# Altium schematic sheet WCAM-BREAKOUT-PCB-R03.SchDoc: WCAM-BREAKOUT-PCB-R03
size 594 x 420 mm; Author: T. Ludemann; Revision: 0.3; SheetNumber: 1; SheetTotal: 1; DocSize: DINA2
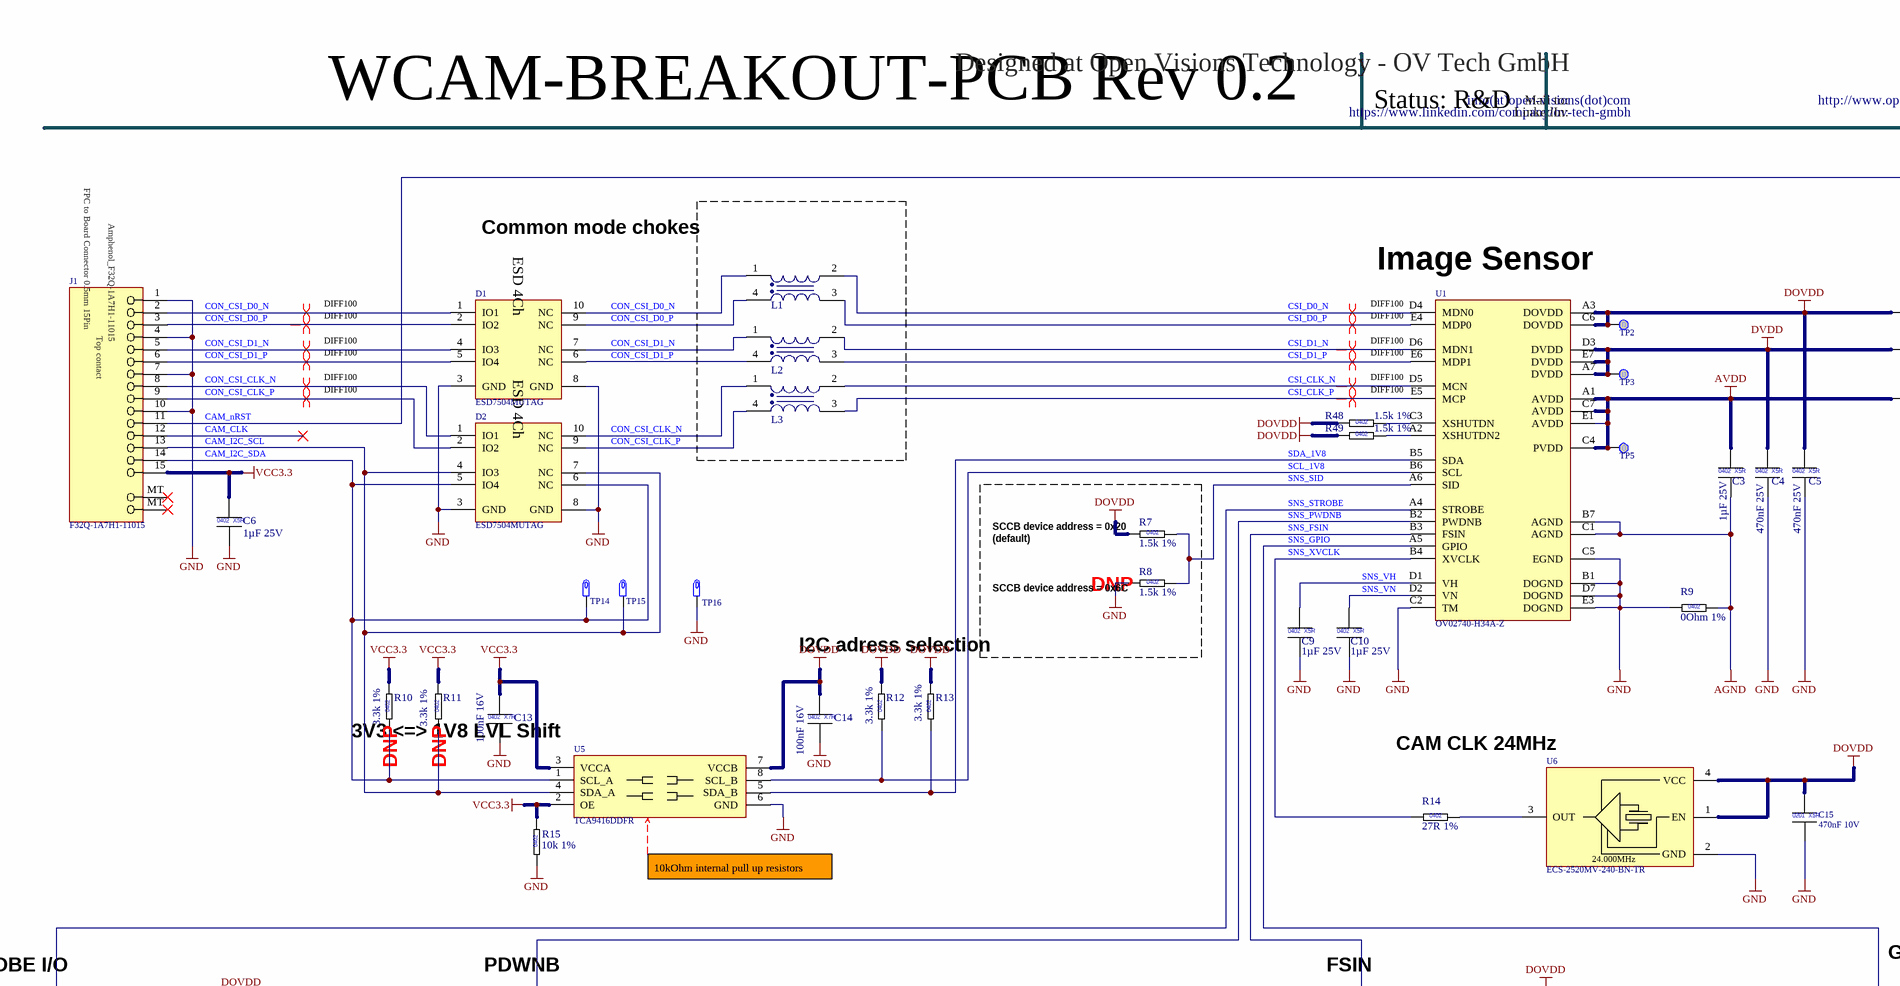
[diagram p0: WCAM-BREAKOUT-PCB-R03.SchDoc, top left]
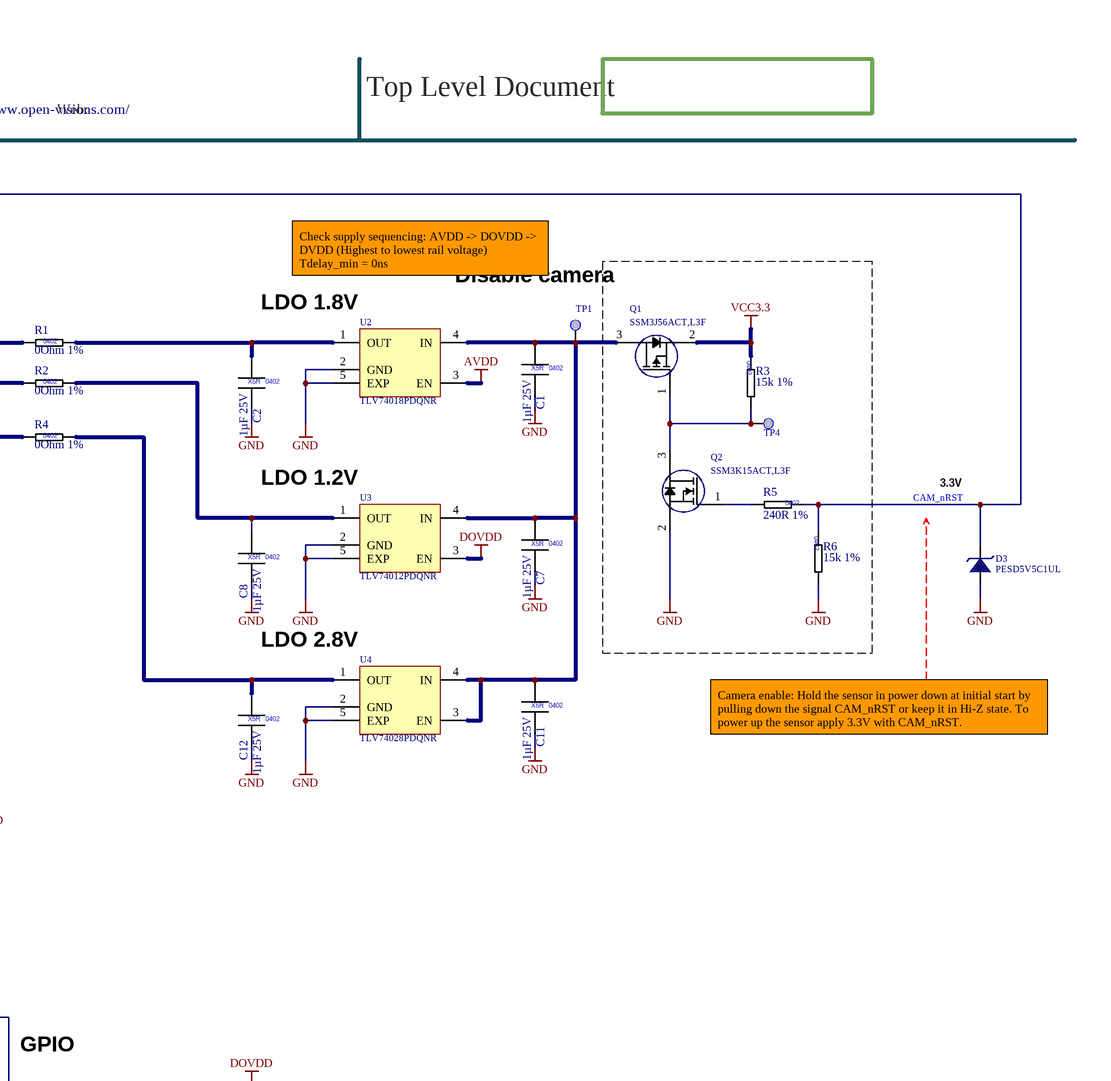
[diagram p1: WCAM-BREAKOUT-PCB-R03.SchDoc, top right]
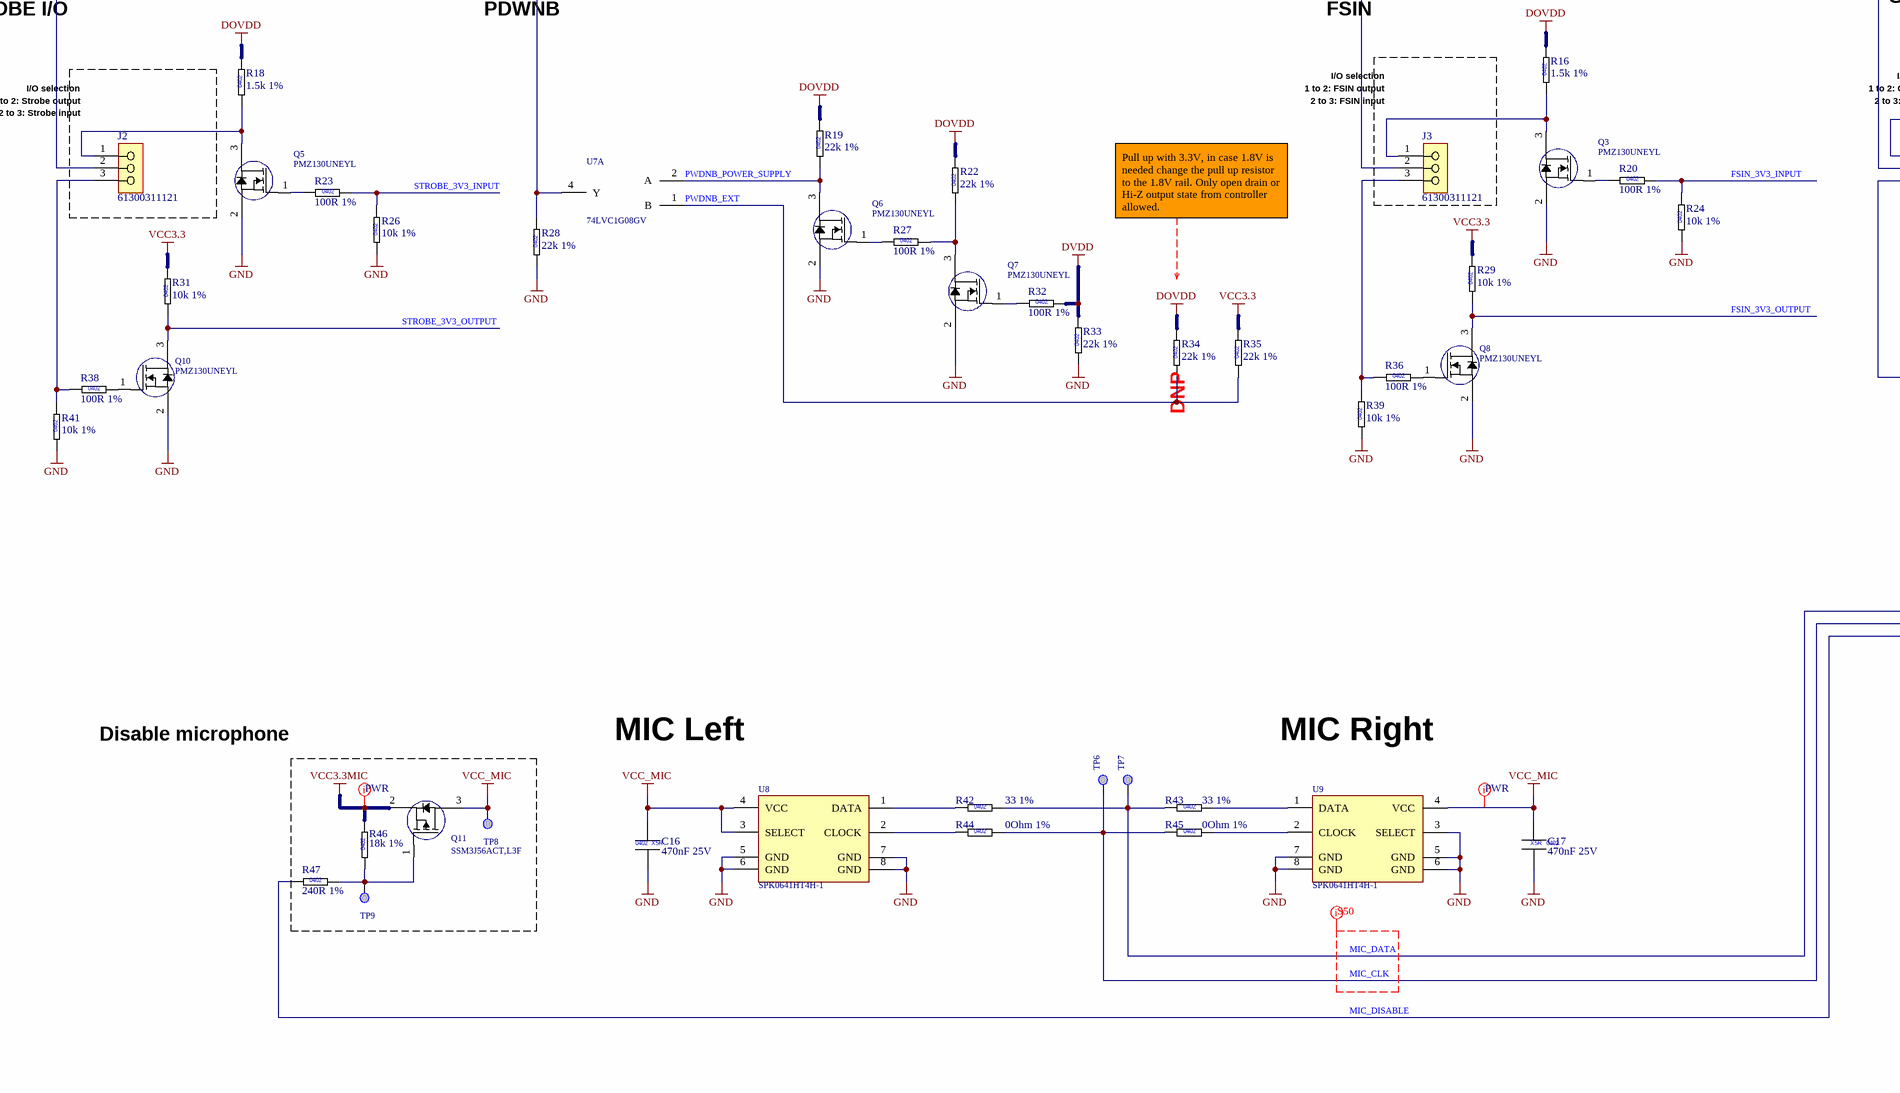
[diagram p2: WCAM-BREAKOUT-PCB-R03.SchDoc, bottom left]
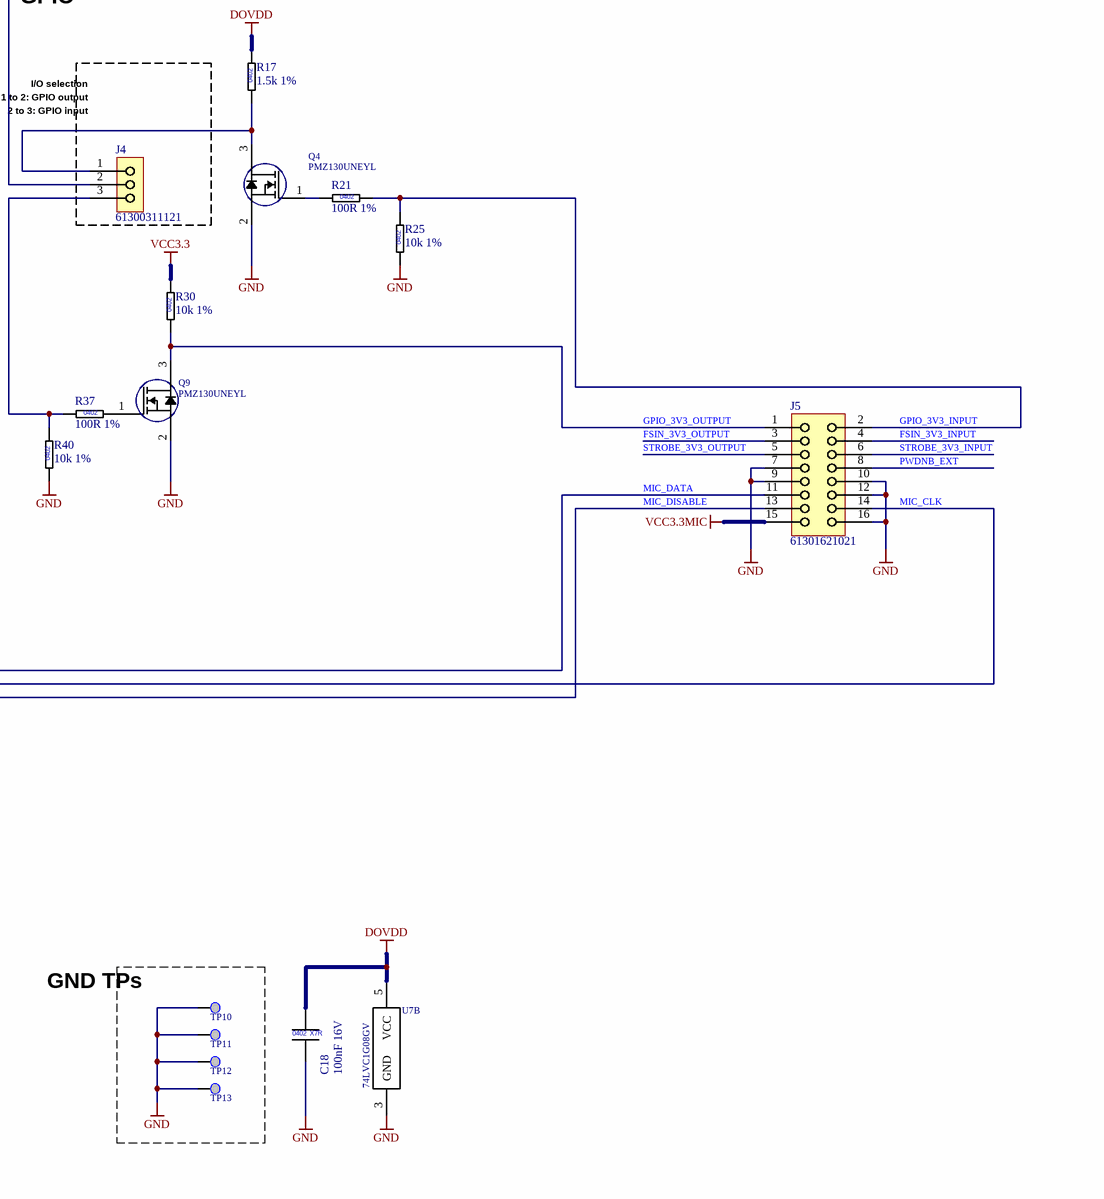
[diagram p3: WCAM-BREAKOUT-PCB-R03.SchDoc, bottom right]

## Parts
?  (no value)  (graphical)
C1  1µF 25V  [CAPC1005X06L]
C2  1µF 25V  [CAPC1005X06L]
C3  1µF 25V  [CAPC1005X06L]
C4  470nF 25V  [CAPC1005X06L]
C5  470nF 25V  [CAPC1005X06L]
C6  1µF 25V  [CAPC1005X06L]
C7  1µF 25V  [CAPC1005X06L]
C8  1µF 25V  [CAPC1005X06L]
C9  1µF 25V  [CAPC1005X06L]
C10  1µF 25V  [CAPC1005X06L]
C11  1µF 25V  [CAPC1005X06L]
C12  1µF 25V  [CAPC1005X06L]
C13  100nF 16V  [CAPC1005X06L]
C14  100nF 16V  [CAPC1005X06L]
C15  470nF 10V  [CAPC0603X03L]
C16  470nF 25V  [CAPC1005X06L]
C17  470nF 25V  [CAPC1005X06L]
C18  100nF 16V  [CAPC1005X06L]
D1  ESD7504MUTAG  [QFN50P250X100X55-10L]
D2  ESD7504MUTAG  [QFN50P250X100X55-10L]
D3  PESD5V5C1UL  [DFN65P100X50-2N]
J1  F32Q-1A7H1-11015  [FFC 15pol 0.5mm F32Q-1A7H1-11015]
J2  61300311121  [BOARD TO BOARD Pinheader WE_61300311121]
J3  61300311121  [BOARD TO BOARD Pinheader WE_61300311121]
J4  61300311121  [BOARD TO BOARD Pinheader WE_61300311121]
J5  61301621021  [BOARD TO BOARD Pinheader WE_61301621021]
L1  90Ohm 100mA  [CAF-50P85X64-4N]  (value not drawn)
L2  90Ohm 100mA  [CAF-50P85X64-4N]  (value not drawn)
L3  90Ohm 100mA  [CAF-50P85X64-4N]  (value not drawn)
Q1  SSM3J56ACT,L3F  [DFN65P100X50-3L]
Q2  SSM3K15ACT,L3F  [DFN65P100X50-3L]
Q3  PMZ130UNEYL  [DFN65P98X50-3N]
Q4  PMZ130UNEYL  [DFN65P98X50-3N]
Q5  PMZ130UNEYL  [DFN65P98X50-3N]
Q6  PMZ130UNEYL  [DFN65P98X50-3N]
Q7  PMZ130UNEYL  [DFN65P98X50-3N]
Q8  PMZ130UNEYL  [DFN65P98X50-3N]
Q9  PMZ130UNEYL  [DFN65P98X50-3N]
Q10  PMZ130UNEYL  [DFN65P98X50-3N]
Q11  SSM3J56ACT,L3F  [DFN65P100X50-3L]
R1  0Ohm 1%  [RESC1005X04L]
R2  0Ohm 1%  [RESC1005X04L]
R3  15k 1%  [RESC1005X04L]
R4  0Ohm 1%  [RESC1005X04L]
R5  240R 1%  [RESC1005X04L]
R6  15k 1%  [RESC1005X04L]
R7  1.5k 1%  [RESC1005X04L]
R8  1.5k 1%  [RESC1005X04L]
R9  0Ohm 1%  [RESC1005X04L]
R10  3.3k 1%  [RESC1005X04L]
R11  3.3k 1%  [RESC1005X04L]
R12  3.3k 1%  [RESC1005X04L]
R13  3.3k 1%  [RESC1005X04L]
R14  27R 1%  [RESC1005X04L]
R15  10k 1%  [RESC1005X04L]
R16  1.5k 1%  [RESC1005X04L]
R17  1.5k 1%  [RESC1005X04L]
R18  1.5k 1%  [RESC1005X04L]
R19  22k 1%  [RESC1005X04L]
R20  100R 1%  [RESC1005X04L]
R21  100R 1%  [RESC1005X04L]
R22  22k 1%  [RESC1005X04L]
R23  100R 1%  [RESC1005X04L]
R24  10k 1%  [RESC1005X04L]
R25  10k 1%  [RESC1005X04L]
R26  10k 1%  [RESC1005X04L]
R27  100R 1%  [RESC1005X04L]
R28  22k 1%  [RESC1005X04L]
R29  10k 1%  [RESC1005X04L]
R30  10k 1%  [RESC1005X04L]
R31  10k 1%  [RESC1005X04L]
R32  100R 1%  [RESC1005X04L]
R33  22k 1%  [RESC1005X04L]
R34  22k 1%  [RESC1005X04L]
R35  22k 1%  [RESC1005X04L]
R36  100R 1%  [RESC1005X04L]
R37  100R 1%  [RESC1005X04L]
R38  100R 1%  [RESC1005X04L]
R39  10k 1%  [RESC1005X04L]
R40  10k 1%  [RESC1005X04L]
R41  10k 1%  [RESC1005X04L]
R42  33 1%  [RESC1005X04L]
R43  33 1%  [RESC1005X04L]
R44  0Ohm 1%  [RESC1005X04L]
R45  0Ohm 1%  [RESC1005X04L]
R46  18k 1%  [RESC1005X04L]
R47  240R 1%  [RESC1005X04L]
R48  1.5k 1%  [RESC1005X04L]
R49  1.5k 1%  [RESC1005X04L]
TP1  Testpoint 0.5mm  [TP_0.50mm]  (value not drawn)  (no BOM)
TP2  Testpoint 0.5mm  [TP_0.50mm]  (value not drawn)  (no BOM)
TP3  Testpoint 0.5mm  [TP_0.50mm]  (value not drawn)  (no BOM)
TP4  Testpoint 0.5mm  [TP_0.50mm]  (value not drawn)  (no BOM)
TP5  Testpoint 0.5mm  [TP_0.50mm]  (value not drawn)  (no BOM)
TP6  Testpoint 0.5mm  [TP_0.50mm]  (value not drawn)  (no BOM)
TP7  Testpoint 0.5mm  [TP_0.50mm]  (value not drawn)  (no BOM)
TP8  Testpoint 0.5mm  [TP_0.50mm]  (value not drawn)  (no BOM)
TP9  Testpoint 0.5mm  [TP_0.50mm]  (value not drawn)  (no BOM)
TP10  Testpoint 0.5mm  [TP_0.50mm]  (value not drawn)  (no BOM)
TP11  Testpoint 0.5mm  [TP_0.50mm]  (value not drawn)  (no BOM)
TP12  Testpoint 0.5mm  [TP_0.50mm]  (value not drawn)  (no BOM)
TP13  Testpoint 0.5mm  [TP_0.50mm]  (value not drawn)  (no BOM)
TP14  4952  [TP_Keystone_4952]  (value not drawn)
TP15  4952  [TP_Keystone_4952]  (value not drawn)
TP16  4952  [TP_Keystone_4952]  (value not drawn)
U1  OV02740-H34A-Z  [BGA34C53P7X5_386X292X388]
U2  TLV74018PDQNR  [X2SON-DFN]
U3  TLV74012PDQNR  [X2SON-DFN]
U4  TLV74028PDQNR  [X2SON-DFN]
U5  TCA9416DDFR  [TSOP65P280X110-8N]
U6  ECS-2520MV-240-BN-TR  [Oscillator_ECS-2520MV]
U7  74LVC1G08GV  [SOT95P275X110-5N]  (parts A,B of 2)
U8  SPK0641HT4H-1  [MIC_SPK0641HT4H-1]
U9  SPK0641HT4H-1  [MIC_SPK0641HT4H-1]

## Blocks framed on the sheet
Common mode chokes: L1-L3
Disable camera: Q1 Q2 R3 R5 R6 TP4
GND TPs: TP10-TP13

## Nets
AGND: C3.2 R9.2 U1.B7(AGND) U1.C1(AGND)
AVDD: C3.1 R4.1 TP5.TP U1.A1(AVDD) U1.C4(PVDD) U1.C7(AVDD) U1.E1(AVDD) U2.3(EN)
DOVDD: C5.1 C14.1 C15.1 C18.1 R1.1 R7.1 R12.2 R13.2 R16.2 R17.2 R18.2 R19.2 R22.2 R34.2 R48.1 R49.1 TP2.TP U1.A3(DOVDD) U1.C6(DOVDD) U3.3(EN) U5.7(VCCB) U6.1(EN) U6.4(VCC) U7.5(VCC)
DVDD: C4.1 R2.1 R32.2 R33.2 TP3.TP U1.A7(DVDD) U1.D3(DVDD) U1.E7(DVDD)
GND: C1.2 C2.2 C4.2 C5.2 C6.2 C7.2 C8.2 C9.2 C10.2 C11.2 C12.2 C13.2 C14.2 C15.2 C16.2 C17.2 C18.2 D1.3(GND) D1.8(GND) D2.3(GND) D2.8(GND) D3.2 J1.1 J1.4 J1.7 J1.10 J5.7 J5.9 J5.10 J5.12 J5.16 Q2.2(S) Q3.2(S) Q4.2(S) Q5.2(S) Q6.2(S) Q7.2(S) Q8.2(S) Q9.2(S) Q10.2(S) R6.2 R8.1 R9.1 R15.1 R24.1 R25.1 R26.1 R28.1 R33.1 R39.1 R40.1 R41.1 TP10.TP TP11.TP TP12.TP TP13.TP TP16.TP U1.B1(DOGND) U1.C2(TM) U1.C5(EGND) U1.D7(DOGND) U1.E3(DOGND) U2.2(GND) U2.5(EXP) U3.2(GND) U3.5(EXP) U4.2(GND) U4.5(EXP) U5.6(GND) U6.2(GND) U7.3(GND) U8.5(GND) U8.6(GND) U8.7(GND) U8.8(GND) U9.3(SELECT) U9.5(GND) U9.6(GND) U9.7(GND) U9.8(GND)
VCC3.3: C6.1 C13.1 J1.15 Q1.2(S) R3.1 R10.2 R11.2 R15.2 R29.2 R30.2 R31.2 R35.2 U5.2(OE) U5.3(VCCA)
VCC3.3MIC: J5.15 Q11.2(S) R46.2
VCC_MIC: C16.1 C17.1 Q11.3(D) TP8.TP U8.3(SELECT) U8.4(VCC) U9.4(VCC)
CAM_CLK: J1.12
CAM_I2C_SCL: D2.4(IO3) D2.7(NC) J1.13 R11.1 TP15.TP U5.4(SDA_A)
CAM_I2C_SDA: D2.5(IO4) D2.6(NC) J1.14 R10.1 TP14.TP U5.1(SCL_A)
CAM_nRST: D3.1 J1.11 R5.1 R6.1
CON_CSI_CLK_N: D2.1(IO1) D2.10(NC) J1.8 L3.1
CON_CSI_CLK_P: D2.2(IO2) D2.9(NC) J1.9 L3.4
CON_CSI_D0_N: D1.1(IO1) D1.10(NC) J1.2 L1.1
CON_CSI_D0_P: D1.2(IO2) D1.9(NC) J1.3 L1.4
CON_CSI_D1_N: D1.4(IO3) D1.7(NC) J1.5 L2.1
CON_CSI_D1_P: D1.5(IO4) D1.6(NC) J1.6 L2.4
CSI_CLK_N: L3.2 U1.D5(MCN)
CSI_CLK_P: L3.3 U1.E5(MCP)
CSI_D0_N: L1.2 U1.D4(MDN0)
CSI_D0_P: L1.3 U1.E4(MDP0)
CSI_D1_N: L2.2 U1.D6(MDN1)
CSI_D1_P: L2.3 U1.E6(MDP1)
FSIN_3V3_INPUT: J5.4 R20.2 R24.2
FSIN_3V3_OUTPUT: J5.3 Q8.3(D) R29.1
GPIO_3V3_INPUT: J5.2 R21.2 R25.2
GPIO_3V3_OUTPUT: J5.1 Q9.3(D) R30.1
MIC_CLK: J5.14 R44.2 R45.1 TP6.TP
MIC_DATA: J5.11 R42.2 R43.1 TP7.TP
MIC_DISABLE: J5.13 R47.1
PWDNB_EXT: J5.8 R34.1 R35.1 U7.1(B)
PWDNB_POWER_SUPPLY: Q6.3(D) R19.1 U7.2(A)
SCL_1V8: R12.1 U1.B6(SCL) U5.8(SCL_B)
SDA_1V8: R13.1 U1.B5(SDA) U5.5(SDA_B)
SNS_FSIN: J3.2 U1.B3(FSIN)
SNS_GPIO: J4.2 U1.A5(GPIO)
SNS_PWDNB: R28.2 U1.B2(PWDNB) U7.4(Y)
SNS_SID: R7.2 R8.2 U1.A6(SID)
SNS_STROBE: J2.2 U1.A4(STROBE)
SNS_VH: C9.1 U1.D1(VH)
SNS_VN: C10.1 U1.D2(VN)
SNS_XVCLK: R14.1 U1.B4(XVCLK)
STROBE_3V3_INPUT: J5.6 R23.2 R26.2
STROBE_3V3_OUTPUT: J5.5 Q10.3(D) R31.1
NetC1_1: C1.1 C7.1 C11.1 Q1.3(D) TP1.TP U2.4(IN) U3.4(IN) U4.3(EN) U4.4(IN)
NetC2_1: C2.1 R1.2 U2.1(OUT)
NetC8_1: C8.1 R2.2 U3.1(OUT)
NetC12_1: C12.1 R4.2 U4.1(OUT)
NetJ2_1: J2.1 Q5.3(D) R18.1
NetJ2_3: J2.3 R38.1 R41.2
NetJ3_1: J3.1 Q3.3(D) R16.1
NetJ3_3: J3.3 R36.1 R39.2
NetJ4_1: J4.1 Q4.3(D) R17.1
NetJ4_3: J4.3 R37.1 R40.2
NetQ1_1: Q1.1(G) Q2.3(D) R3.2 TP4.TP
NetQ2_1: Q2.1(G) R5.2
NetQ3_1: Q3.1(G) R20.1
NetQ4_1: Q4.1(G) R21.1
NetQ5_1: Q5.1(G) R23.1
NetQ6_1: Q6.1(G) R27.1
NetQ7_1: Q7.1(G) R32.1
NetQ7_3: Q7.3(D) R22.1 R27.2
NetQ8_1: Q8.1(G) R36.2
NetQ9_1: Q9.1(G) R37.2
NetQ10_1: Q10.1(G) R38.2
NetQ11_1: Q11.1(G) R46.1 R47.2 TP9.TP
NetR14_2: R14.2 U6.3(OUT)
NetR42_1: R42.1 U8.1(DATA)
NetR43_2: R43.2 U9.1(DATA)
NetR44_1: R44.1 U8.2(CLOCK)
NetR45_2: R45.2 U9.2(CLOCK)
NetR48_2: R48.2 U1.C3(XSHUTDN)
NetR49_2: R49.2 U1.A2(XSHUTDN2)

Not connected (* = marked no-connect by the designer): J1 MT*

## Layout directives
differential pair; differential pair class DIFF100: CON_CSI_CLK_N, CON_CSI_CLK_P, CON_CSI_D0_N, CON_CSI_D0_P, CON_CSI_D1_N, CON_CSI_D1_P, CSI_CLK_N, CSI_CLK_P, CSI_D0_N, CSI_D0_P, CSI_D1_N, CSI_D1_P
net class PWR: VCC3.3MIC, VCC_MIC
net class S50: MIC_CLK, MIC_DATA

## Notes on the sheet
- Designed at Open Visions Technology - OV Tech GmbH
- Mail to:
- info(at)open-visions(dot)com
- Web:
- http://www.open-visions.com/
- Top Level Document
- WCAM-BREAKOUT-PCB Rev 0.2
- Status: R&D
- LinkedIn:
- https://www.linkedin.com/company/ov-tech-gmbh
- Image Sensor
- Check supply sequencing: AVDD -> DOVDD -> DVDD (Highest to lowest rail voltage)
  Tdelay_min = 0ns
- (near U2) LDO 1.8V
- (near U3) LDO 1.2V
- 3.3V
- (near R7) SCCB device address = 0x20
- (default)
- (near R8) DNP
- (near U4) LDO 2.8V
- (near R8) SCCB device address = 0x6C
- I2C adress selection
- Camera enable: Hold the sensor in power down at initial start by pulling down the signal CAM_nRST or keep it in Hi-Z state. To power up the sensor apply 3.3V with CAM_nRST.
- (near R10) DNP
- (near R11) DNP
- (near U5) 3V3 <=> 1V8 LVL Shift
- (near U6) CAM CLK 24MHz
- 10kOhm internal pull up resistors
- STROBE I/O
- PDWNB
- FSIN
- GPIO
- I/O selection
- 1 to 2: Strobe output
- (near J2) 2 to 3: Strobe input
- 1 to 2: FSIN output
- 2 to 3: FSIN input
- 1 to 2: GPIO output
- 2 to 3: GPIO input
- Pull up with 3.3V, in case 1.8V is needed change the pull up resistor to the 1.8V rail. Only open drain or Hi-Z output state from controller allowed.
- (near R34) DNP
- Disable microphone
- MIC Left
- MIC Right
- OV Tech GmbH - Open Visions Technology
- (in symbol 15Pin_FPC-to-board_Amphenol F32Q-1A7H1-11015) FPC to Board Connector 0.5mm 15Pin; Amphenol_F32Q-1A7H1-11015; Top contact
- (in symbol CAP_0201_470nF_10V) 0201; X5R
- (in symbol CAP_0402_1µ_25V) 0402; X5R
- (in symbol CAP_0402_100nF_16V) 0402; X7R
- (in symbol CAP_0402_470n_25V) 0402; X5R
- (in symbol Crystal Oscillator_ECS-2520MV-240-BN-TR) 24.000MHz
- (in symbol ESD Protection Diode_ESD7504MUTAG) ESD 4Ch
- (in symbol RES_0402_0R_1%) 0402
- (in symbol RES_0402_1.5k_1%) 0402
- (in symbol RES_0402_3.3k_1%) 0402
- (in symbol RES_0402_10k_1%) 0402
- (in symbol RES_0402_15k_1%) 0402
- (in symbol RES_0402_18k_%) 0402
- (in symbol RES_0402_22k_1%) 0402
- (in symbol RES_0402_27R_1%) 0402
- (in symbol RES_0402_33R_1%) 0402
- (in symbol RES_0402_100R_1%) 0402
- (in symbol RES_0402_240R_1%) 0402

## Library data of the parts
? = Titleblock_01_OpenSource
C1-C3 C6-C12 = CAP_0402_1µ_25V: Multilayer Ceramic Capacitors MLCC - SMD/SMT 0402 25VDC; Manufacturer 1: Murata Electronics; Manufacturer 1 Prt. Nr.: GRM155R61E105KE11D; Manufacturer 2 Prt. Nr.: 0402X105K250CT; Manufacturer 2: Walsin
C4 C5 C16 C17 = CAP_0402_470n_25V: Multilayer Ceramic Capacitors MLCC - SMD/SMT 0402 25VDC; Manufacturer 1: Murata Electronics; Manufacturer 1 Prt. Nr.: GRM155R61E474KE01D; Manufacturer 2 Prt. Nr.: 0603X474K250CT; Manufacturer 2: Walsin
C13 C14 C18 = CAP_0402_100nF_16V: Multilayer Ceramic Capacitors MLCC - SMD/SMT 0402 16VDC; Manufacturer 1: KYOCERA AVX; Manufacturer 1 Prt. Nr.: KGM05AR71C104KH; Manufacturer 2 Prt. Nr.: EMK105B7104KV-F; Manufacturer 2: Taiyo Yuden
C15 = CAP_0201_470nF_10V: Multilayer Ceramic Capacitors MLCC - SMD/SMT 0201 10VDC; Manufacturer 1: Taiyo Yuden; Manufacturer 1 Prt. Nr.: LMK063BBJ474KPLF; Manufacturer 2 Prt. Nr.: C0603X5R1A474M030BC; Manufacturer 2: TDK
D1 D2 = ESD Protection Diode_ESD7504MUTAG: ESD-Entstörer/TVS-Dioden LOW CAP ESD Protection; Manufacturer 1: onsemi; Manufacturer 1 Prt. Nr.: ESD7504MUTAG
D3 = ESD 5.5V_PESD5V5C1UL: ESD Diode 5.5V working voltage DFN1006-2; Manufacturer 1: Nexperia; Manufacturer 1 Prt. Nr.: PESD5V5C1UL
J1 = 15Pin_FPC-to-board_Amphenol F32Q-1A7H1-11015: Flex Connector, 0.50mm Pitch, Height 2.00mm, Right angle, Slider type, ZIF, Upper contact, 15 position , Without MYLAR; Manufacturer 1: Amphenol FCI; Manufacturer 1 Prt. Nr.: F32Q-1A7H1-11015
J2-J4 = Pin Header_3pol_61300311121: Pin Header 3 Pol 2.54mm; Manufacturer 1: Würth elektronik; Manufacturer 1 Prt. Nr.: 61300311121
J5 = Pin Header_16pol_61301621021: Pin Header 3 Pol 2.54mm; Manufacturer 1: Würth elektronik; Manufacturer 1 Prt. Nr.: 61301621021
L1-L3 = Common Mode Choke_LM0NSM900HY2#: Murata Common Mode Choke 90Ohm 100mA for ,USB2.0,USB3.1 Gen1,USB3.1 Gen2,MIPI D-PHY Ver1.1,MIPI D-PHY Ver1.2,HDMI 1.4b; Manufacturer 1: Murata Electronics; Manufacturer 1 Prt. Nr.: DLM0NSM900HY2D
Q1 Q11 = P-Channel MOSFET_SSM3J56ACT,L3F: MOSFET 20V SGL P-CH TRENCHMOS Logic Level; Manufacturer 1: Toshiba; Manufacturer 1 Prt. Nr.: SSM3J56ACT,L3F
Q2 = N-Channel MOSFET_SSM3K15ACT,L3F: MOSFET 30V SGL N-CH TRENCHMOS Logic Level; Manufacturer 1: Toshiba; Manufacturer 1 Prt. Nr.: SSM3K15ACT,L3F
Q3-Q10 = N-Channel MOSFET_PMZ130UNEYL: MOSFET PMZ130UNE/SOT883/XQFN3; Manufacturer 1: Nexperia; Manufacturer 1 Prt. Nr.: PMZ130UNEYL
R1 R2 R4 R9 R44 R45 = RES_0402_0R_1%: Thick Film Resistors - SMD 0OHM 1%; Manufacturer 1: Bourns; Manufacturer 1 Prt. Nr.: CR0402AJ/-000GAS; Manufacturer 2 Prt. Nr.: AC0402FR-070RL; Manufacturer 2: YAGEO
R3 R6 = RES_0402_15k_1%: Thick Film Resistors - SMD 15k 1%; Manufacturer 1: Vishay / Dale; Manufacturer 1 Prt. Nr.: CRCW040215K0FKED; Manufacturer 2 Prt. Nr.: RT0402FRE0715KL; Manufacturer 2: YAGEO
R5 R47 = RES_0402_240R_1%: Thick Film Resistors - SMD 240 OHM 1%; Manufacturer 1: Yageo; Manufacturer 1 Prt. Nr.: RC0402FR-07240RL; Manufacturer 2 Prt. Nr.: CR0402-FX-2400GLF; Manufacturer 2: Bourns
R7 R8 R16-R18 R48 R49 = RES_0402_1.5k_1%: Thick Film Resistors - SMD 1.5k 1%; Manufacturer 1: Vishay / Dale; Manufacturer 1 Prt. Nr.: CRCW04021K50FKED; Manufacturer 2 Prt. Nr.: RC0402FR-131K5L; Manufacturer 2: YAGEO
R10-R13 = RES_0402_3.3k_1%: Thick Film Resistors - SMD 3.3k 1%; Manufacturer 1: Bourns; Manufacturer 1 Prt. Nr.: CR0402-FX-3301GLF; Manufacturer 2 Prt. Nr.: RC0402FR-7D3K3L; Manufacturer 2: YAGEO
R14 = RES_0402_27R_1%: Thick Film Resistors - SMD 27R 1%; Manufacturer 1: YAGEO; Manufacturer 1 Prt. Nr.: RC0402FR-0727RL; Manufacturer 2 Prt. Nr.: CRGCQ0402F27R; Manufacturer 2: TE Connectivity Passive Product
R15 R24-R26 R29-R31 R39-R41 = RES_0402_10k_1%: Thick Film Resistors - SMD 10k 1%; Manufacturer 1: Vishay / Dale; Manufacturer 1 Prt. Nr.: CRCW040210K0FKEDC; Manufacturer 2 Prt. Nr.: RT0402FRE0710KL; Manufacturer 2: YAGEO
R19 R22 R28 R33-R35 = RES_0402_22k_1%: Thick Film Resistors - SMD 22k 1%; Manufacturer 1: Vishay / Dale; Manufacturer 1 Prt. Nr.: CRCW040222K0FKED; Manufacturer 2 Prt. Nr.: RC0402FR-0722KL; Manufacturer 2: YAGEO
R20 R21 R23 R27 R32 R36-R38 = RES_0402_100R_1%: Thick Film Resistors - SMD 100R 1%; Manufacturer 1: Vishay / Dale; Manufacturer 1 Prt. Nr.: CRCW0402100RFKEDC; Manufacturer 2 Prt. Nr.: RC0402FR-07100RL; Manufacturer 2: YAGEO
R42 R43 = RES_0402_33R_1%: Thick Film Resistors - SMD 33 Ohm 1%; Manufacturer 1: Panasonic; Manufacturer 1 Prt. Nr.: ERJ-S02F33R0X; Manufacturer 2 Prt. Nr.: CRCW040233R0FKED; Manufacturer 2: Vishay / Dale
R46 = RES_0402_18k_%: Thick Film Resistors - SMD 18k 1%; Manufacturer 1: Bourns; Manufacturer 1 Prt. Nr.: CR0402-FX-1802GLF; Manufacturer 2 Prt. Nr.: CRCW040218K0FKEDC; Manufacturer 2: Vishay
TP14-TP16 = Testpoint_Keystone_4952: Loop Type THM Test Point P/N 4952; Manufacturer 1: Keystone; Manufacturer 1 Prt. Nr.: 4952
U1 = Image Sensor_OV2740: MIPI CSI Image Sensor 1080p 1/6"; Manufacturer 1 Prt. Nr.: OmniVision; Manufacturer 1: OV02740-H34A-Z
U2 = LDO 1.8V_TLV74018PDQNR: LDO voltage regulator 300mA X2SON; Manufacturer 1: Texas Instruments; Manufacturer 1 Prt. Nr.: TLV74018PDQNR
U3 = LDO 1.2V_TLV74012PDQNR: LDO voltage regulator 300mA X2SON; Manufacturer 1: Texas Instruments; Manufacturer 1 Prt. Nr.: TLV74012PDQNR
U4 = LDO 2.8V_TLV74028PDQNR: LDO voltage regulator 300mA X2SON; Manufacturer 1: Texas Instruments; Manufacturer 1 Prt. Nr.: TLV74028PDQNR
U5 = I2C_Bidirectional_LvL Shift_TCA9416DDFR: Ultra-low voltage I2C translator with rise time accelerators; Manufacturer 1: Texas Instruments; Manufacturer 1 Prt. Nr.: TCA9416DDFR
U6 = Crystal Oscillator_ECS-2520MV-240-BN-TR: Crystal Oscillator 2520 miniature SMD package; Manufacturer 1: ECS; Manufacturer 1 Prt. Nr.: ECS-2520MV-240-BN-TR
U7 = AND_SINGLE_2 INPUT_74LVC1G08GV: Single 2-input AND gate; Manufacturer 1: Nexperia; Manufacturer 1 Prt. Nr.: 74LVC1G08GV
U8 U9 = Digital Microphone PDM_SPK0641HT4H-1: Digital MEMS Microphone Top Port PDM SPK0641HT4H-1; Manufacturer 1: Knowles; Manufacturer 1 Prt. Nr.: SPK0641HT4H-1